# EAGLE design switch-pth-20mm-mk-1.0 (EAGLE 7.5.0)
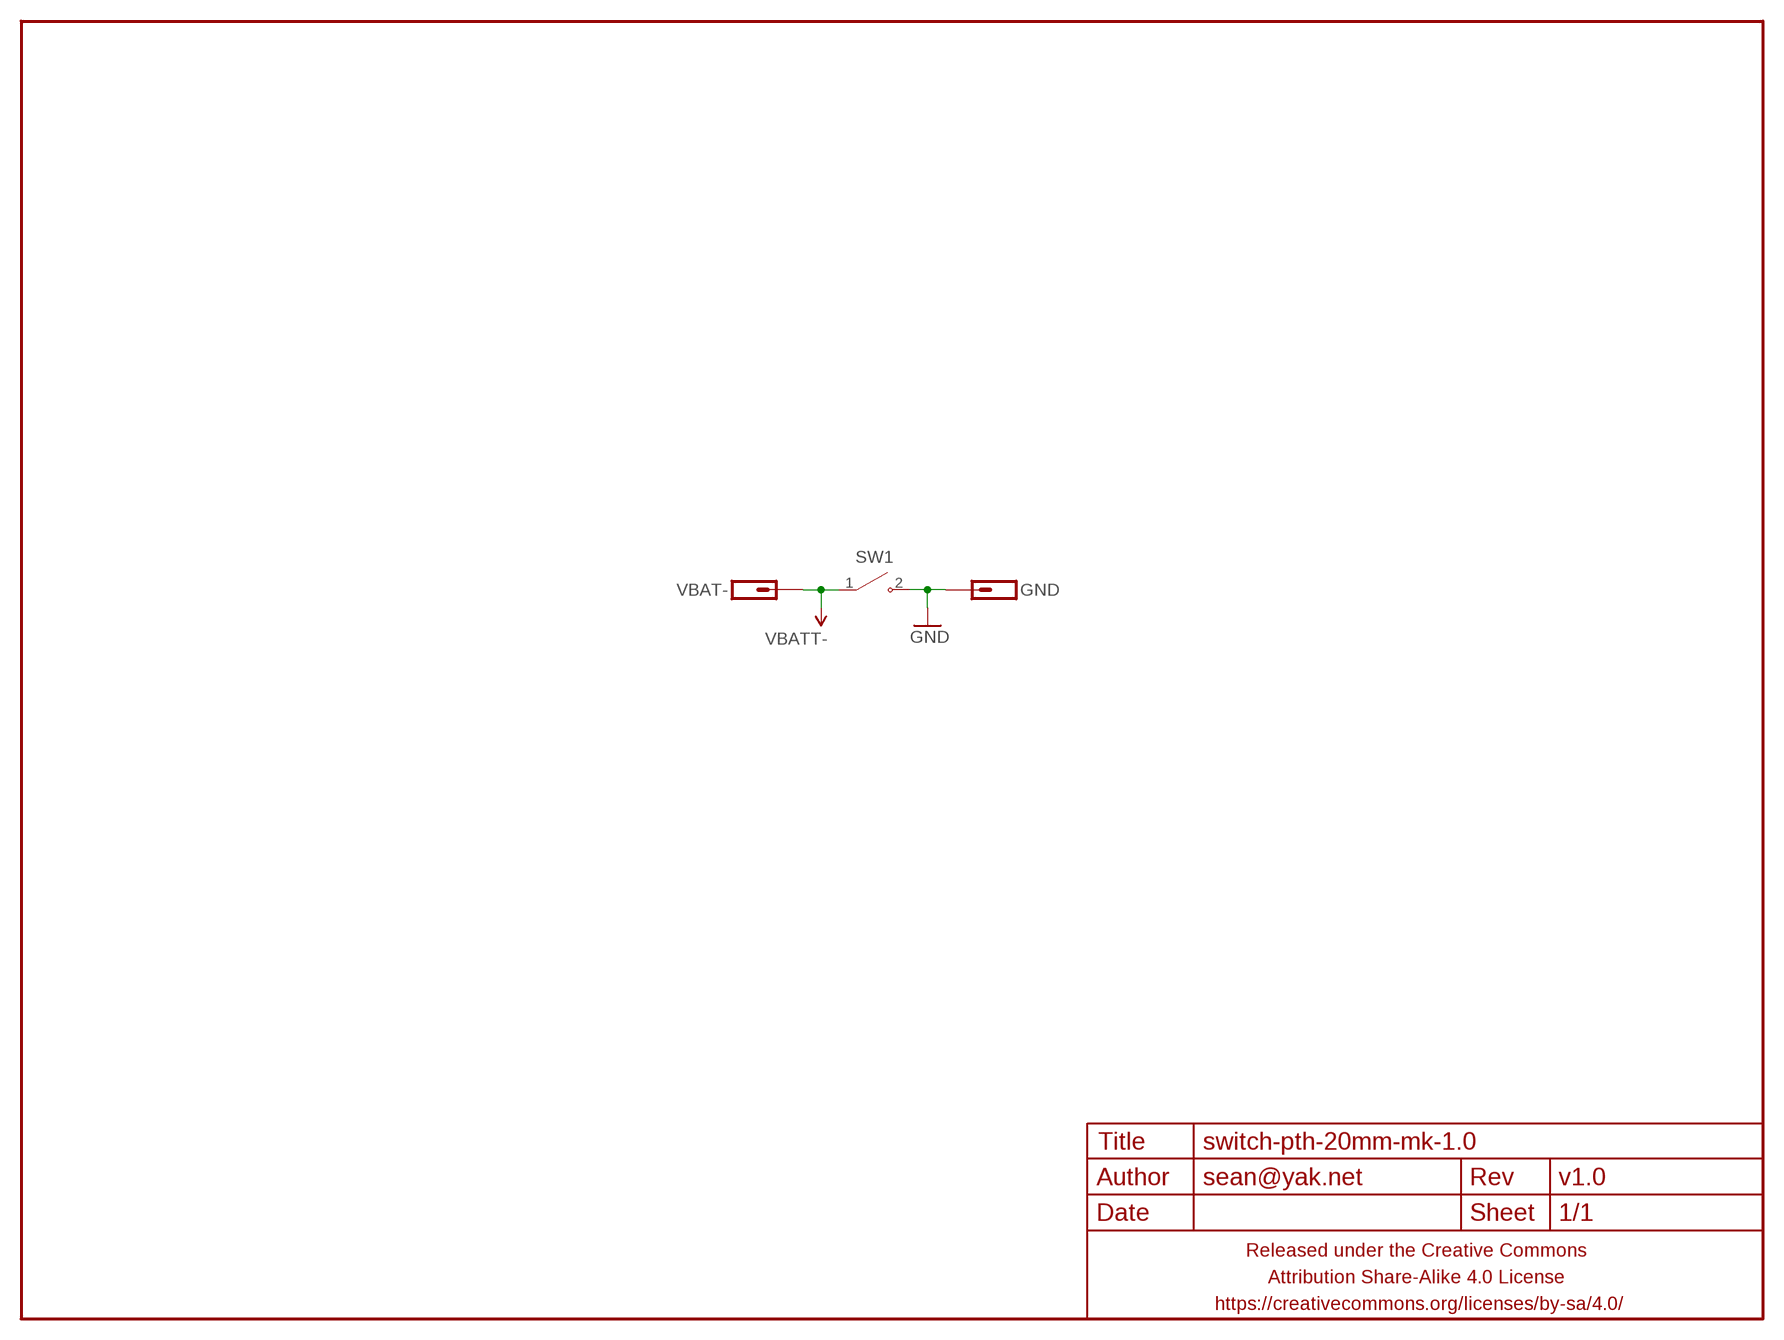
[diagram p0: schematic, sheet 1]

## Parts
FRAME1  FRAME-LETTERNO_PACKAGE  [DUMMY]
GND  M01NOT-A-VIA-NOPE  [1X01_NOSILK_NOSTOP]
SW1  SWITCH-SPSTOMTEN-1288-PTH  [OMTEN-1288-PTH]
VBAT-  M01PTH-1MM-CIR-NS  [1X01-1MM-CIR-NS]

## Nets
GND: GND.P$1 SW1.2(NO)
VBAT: SW1.1(COM) VBAT-.1 ; supply symbol labelled VBATT-

## Library data of the parts
FRAME1 = a_parts:FRAME-LETTER: Schematic Frame Standard 8.5x11 US Letter frame; DESIGNER: sean@yak.net; VERSION: v1.0
GND VBAT- = a_parts:M01: Header 1 Standard 1-pin 0.1" header. Use with straight break away headers (SKU : PRT-00116), right angle break away headers (PRT-00553), swiss pins (PRT-00743), machine pins (PRT-00117), and female headers (PRT-00115).
SW1 = a_parts:SWITCH-SPST

## Board
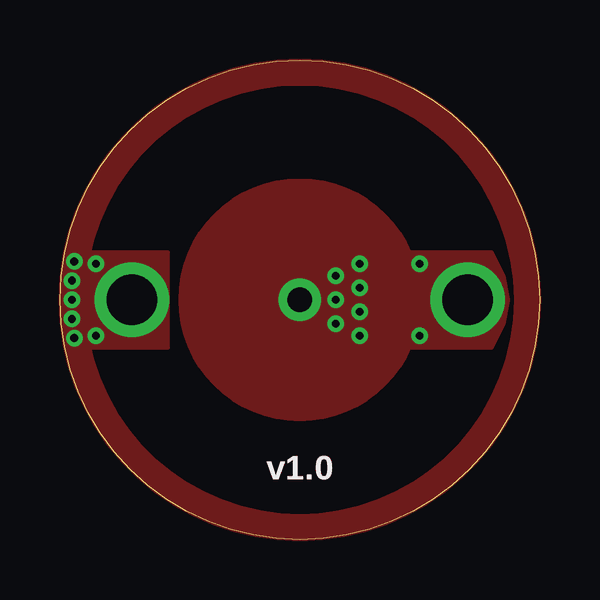
[diagram p1: board, top side]
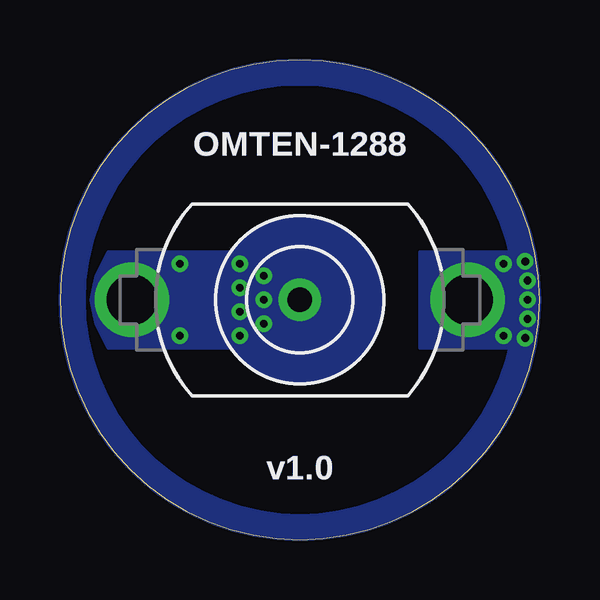
[diagram p2: board, bottom side, seen from below]

Size 20 x 20 mm. Coordinates in mm from the lower left corner, seen from the top.
Outline: 0,10 arc-180 20,10 arc-180 0,10
Copper layers (1*16): Top 0.0356mm / dielectric 1.5011mm / Bottom 0.0356mm
Design rules "LaenPCBOrder2 *": minimum track width 6mil, minimum drill 13mil, track to track 6mil, track to pad 6mil, pad to pad 6mil, via to via 6mil, smd to smd 6mil, copper to edge 0mil, drill to drill 6mil, minimum pad ring 7mil, minimum via ring 7mil, stop-mask expansion 3mil, vias tented up to drill 20mil, thermal gap 10mil

### Footprints (pad centres in the part's own frame; a part is rotated, then mirrored left to right if it is on the bottom)
1X01_NOSILK_NOSTOP = drill 0.33: P$1 0,0
OMTEN-1288-PTH = drill 2.1 pad 3.1: 1 -7,0; 2 7,0
1X01-1MM-CIR-NS = drill 1.016 pad 1.778: 1 0,0

### Placement (x,y rotation side)
FRAME1  0,0 0 top
GND  0.5,10 90 bottom
SW1  10,10 0 bottom
VBAT-  10,10 0 top

### Tracks (layer width: path | path; a pad name or v marks a point on that pad's centre or on a via)
GND  (via drill 0.33)
  other vias: 1.5,11.5 1.5,8.5 0.5,10.8 0.5,9.2 0.6,11.6 0.6,8.4
  pour Top (isolate 0.152, rank 6, no thermals): 20,10 arc90 10,20 arc90 0,10 1,10 arc-90 10,19 arc-90 19,10
  pour Top (isolate 0.152, rank 6, no thermals): 0,10 arc90 10,0 arc90 20,10 19,10 arc-90 10,1 arc-90 1,10
  pour Bottom (isolate 0.152, rank 6, no thermals): 20,10 arc90 10,20 arc90 0,10 1,10 arc-90 10,19 arc-90 19,10
  pour Bottom (isolate 0.152, rank 6, no thermals): 0,10 arc90 10,0 arc90 20,10 19,10 arc-90 10,1 arc-90 1,10
  pour Bottom (isolate 0.152, rank 3, no thermals): 5,12 5,8 0.5,8 0.1,10 0.5,12
  pour Top (isolate 0.152, rank 3, no thermals): 4.5,12 4.5,8 0.5,8 0.1,10 0.5,12
VBAT  (via drill 0.33)
  other vias: 11.5,9 11.5,10 11.5,11 12.5,10.5 12.5,9.5 15,11.5 15,8.5 12.5,11.5 12.5,8.5
  pour Top (isolate 0.152, no thermals): 5,10 arc-180 15,10 arc-180
  pour Bottom (isolate 0.152, rank 3, no thermals): 10,13.5 arc90 6.5,10 arc90 10,6.5 arc90 13.5,10 arc90
  pour Bottom (isolate 0.152, rank 3, no thermals): 8.5,12 18,12 18.5,11 18.7,10 18.5,9 18,8 8.5,8
  pour Top (isolate 0.152, rank 3, no thermals): 8.5,12 18,12 18.5,11 18.7,10 18.5,9 18,8 8.5,8

### Text on the board
Bottom: OMTEN-1288
bPlace: OMTEN-1288